# EAGLE schematic sm9 (EAGLE 9.6.0)
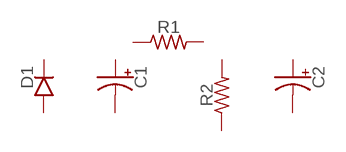
[diagram p0: schematic, sheet 1]

## Parts
C1  0500  [050_020]
C2  0500  [050_020]
D1  DO35.2  [DO35-2]
R1  R_.3B  [R0207/3]
R2  R_.3B  [R0207/3]
Unconnected: C1.+ C1.- C2.+ C2.- D1.A D1.C R1.1 R1.2 R2.1 R2.2

## Library data of the parts
C1 C2 = pedals-capacitors-elec:050
D1 = pedals-diodes:DO35: DO-35 Package Diodes: 1N914
R1 R2 = pedals-resistors:R_